# EAGLE design ESP32 (EAGLE 9.6.2)
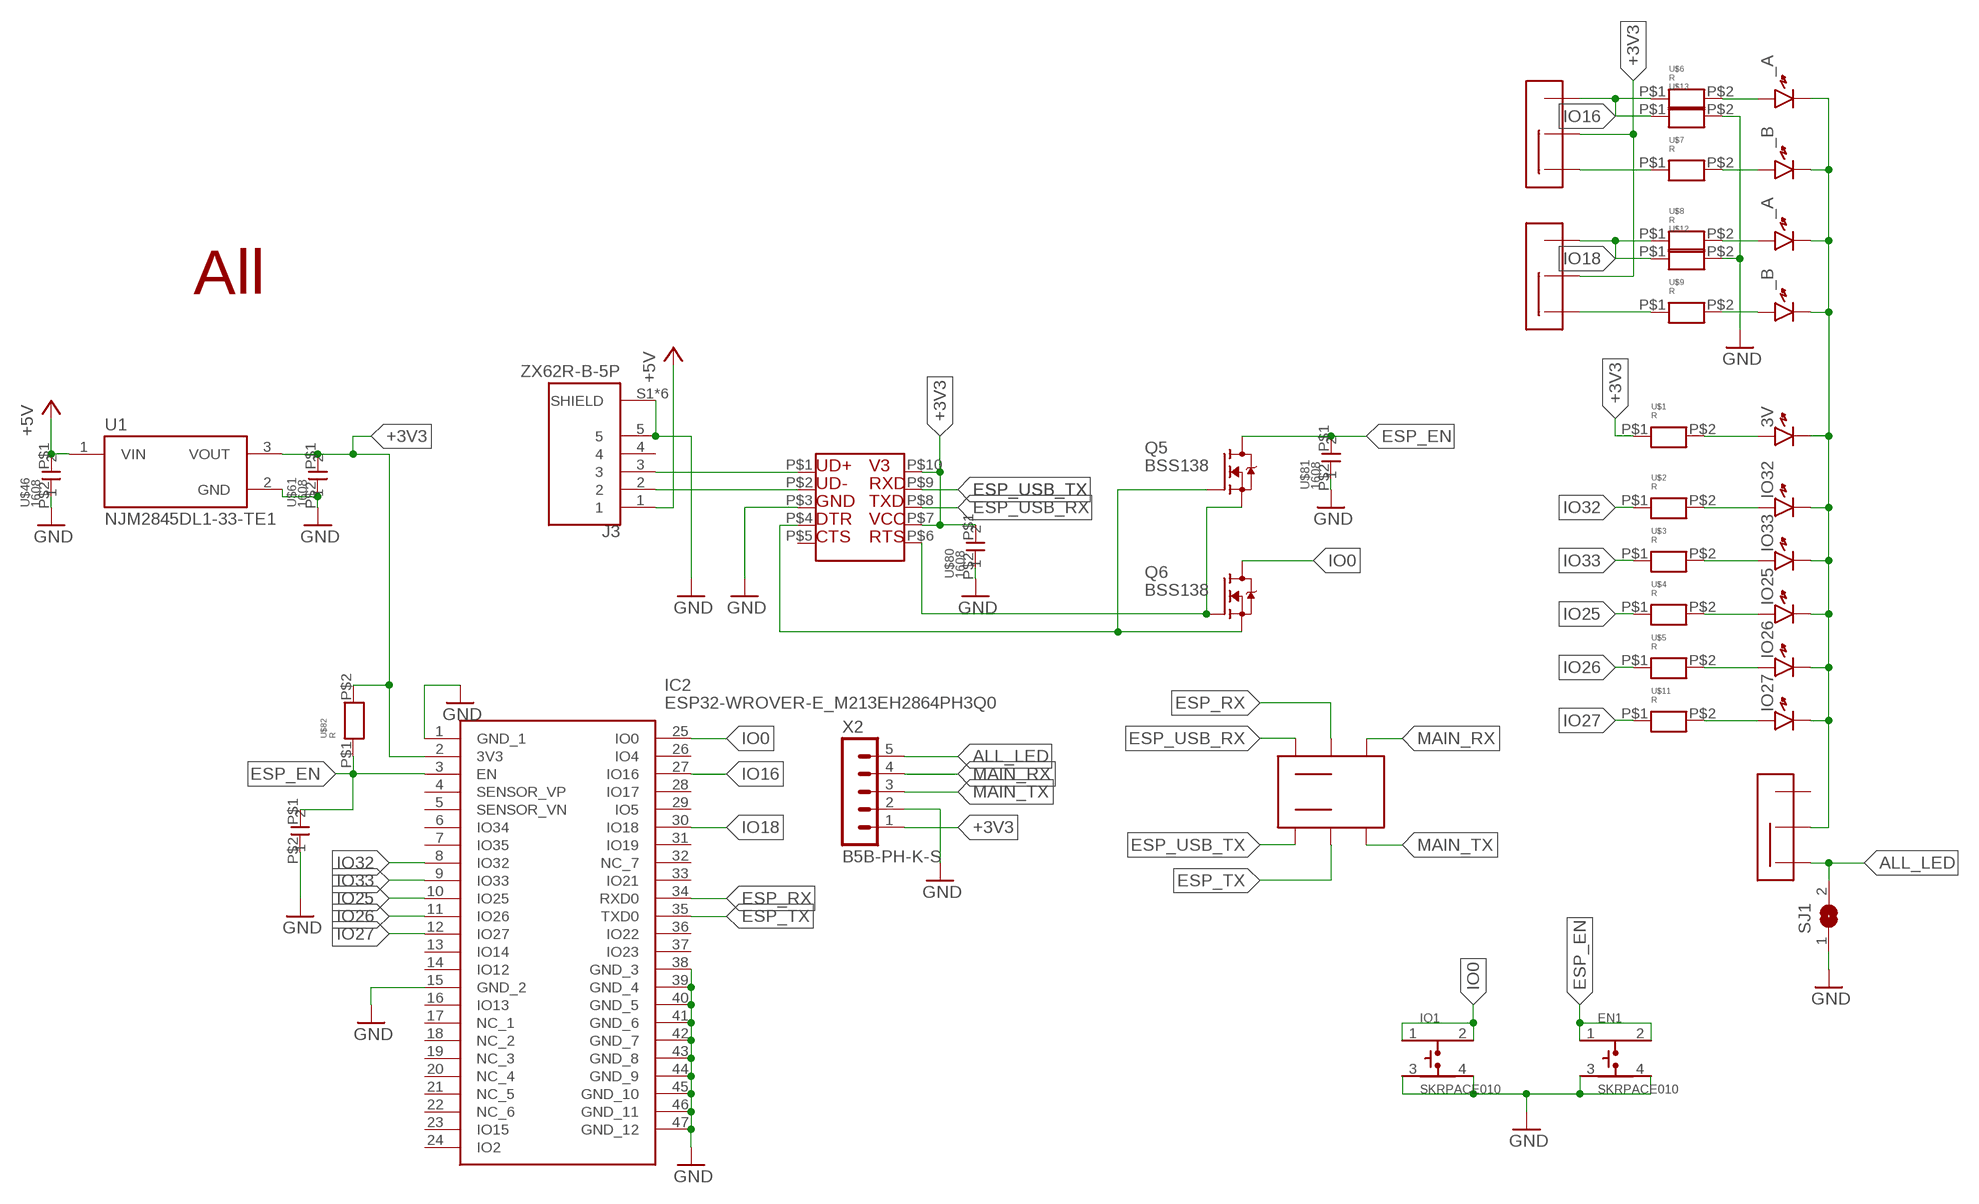
[diagram p0: schematic, sheet 1]

## Parts
3V  LED1608  [LED1608]
EN1  SKRPACE010  [SW_SKRPACE010]
IC2  ESP32-WROVER-E_M213EH2864PH3Q0  [ESP32WROVEREM213EH2864PH3Q0]
IO1  SKRPACE010  [SW_SKRPACE010]
IO25  LED1608  [LED1608]
IO26  LED1608  [LED1608]
IO27  LED1608  [LED1608]
IO32  LED1608  [LED1608]
IO33  LED1608  [LED1608]
J3  ZX62R-B-5P  [HRS_ZX62R-B-5P]
Q5  BSS138  [SOT23]
Q6  BSS138  [SOT23]
SJ1  SJ  [SJ]
U1  NJM2845DL1-33-TE1  [DPAK228P968X238-4N]
U$1  R  [1608]
U$2  R  [1608]
U$3  R  [1608]
U$4  R  [1608]
U$5  R  [1608]
U$6  R  [1608]
U$7  R  [1608]
U$8  R  [1608]
U$9  R  [1608]
U$10  SSW  [SSW]
U$11  R  [1608]
U$12  R  [1608]
U$13  R  [1608]
U$14  ALL  [ALL]
U$46  1608  [CON]
U$61  1608  [CON]
U$79  CH340K  [CH340K]
U$80  1608  [CON]
U$81  1608  [CON]
U$82  R  [1608]
U$83  1608  [CON]
U$84  2SW  [2SW]
U$89  SSW  [SSW]
U$90  SSW  [SSW]
X2  B5B-PH-K-S  [B5B-PH-K-S]
Ⅰ_A  LED1608  [LED1608]
Ⅰ_B  LED1608  [LED1608]
Ⅱ_A  LED1608  [LED1608]
Ⅱ_B  LED1608  [LED1608]

## Nets
+3V3 [New Class]: IC2.2(3V3) U1.3(VOUT) U$1.P$1 U$61.P$1 U$79.P$7 U$79.P$10 U$80.P$1 U$82.P$2 U$89.P$3 U$90.P$3 X2.1
+5V [New Class]: J3.1 U1.1(VIN) U$46.P$1
ALL_LED [New Class]: SJ1.2 U$10.P$1 X2.5
ESP_EN: EN1.1 EN1.2 IC2.3(EN) Q5.3(D) U$81.P$1 U$82.P$1 U$83.P$1
ESP_RX: IC2.34(RXD0) U$84.P$2
ESP_TX: IC2.35(TXD0) U$84.P$5
ESP_USB_RX: U$79.P$8 U$84.P$1
ESP_USB_TX: U$79.P$9 U$84.P$6
GND [New Class]: EN1.3 EN1.4 IC2.1(GND_1) IC2.15(GND_2) IC2.38(GND_3) IC2.39(GND_4) IC2.40(GND_5) IC2.41(GND_6) IC2.42(GND_7) IC2.43(GND_8) IC2.44(GND_9) IC2.45(GND_10) IC2.46(GND_11) IC2.47(GND_12) IO1.3 IO1.4 J3.5 J3.S1(SHIELD) J3.S2(SHIELD) J3.S3(SHIELD) J3.S4(SHIELD) J3.S5(SHIELD) J3.S6(SHIELD) SJ1.1 U1.2(GND) U$12.P$2 U$13.P$2 U$46.P$2 U$61.P$2 U$79.P$3 U$80.P$2 U$81.P$2 U$83.P$2 X2.2
IO0: IC2.25(IO0) IO1.1 IO1.2 Q6.3(D)
IO16: IC2.27(IO16) U$6.P$1 U$13.P$1 U$89.P$2
IO18: IC2.30(IO18) U$8.P$1 U$12.P$1 U$90.P$2
IO25: IC2.10(IO25) U$4.P$1
IO26: IC2.11(IO26) U$5.P$1
IO27: IC2.12(IO27) U$11.P$1
IO32: IC2.8(IO32) U$2.P$1
IO33: IC2.9(IO33) U$3.P$1
MAIN_RX: U$84.P$3 X2.4
MAIN_TX: U$84.P$4 X2.3
N$1: 3V.A U$1.P$2
N$2: Q5.1(G) Q6.2(S) U$79.P$4
N$3: Q5.2(S) Q6.1(G) U$79.P$6
N$4: J3.2 U$79.P$2
N$5: IO32.A U$2.P$2
N$6: J3.3 U$79.P$1
N$7: IO33.A U$3.P$2
N$8: IO25.A U$4.P$2
N$9: IO26.A U$5.P$2
N$10 [New Class]: 3V.K IO25.K IO26.K IO27.K IO32.K IO33.K U$10.P$3 Ⅰ_A.K Ⅰ_B.K Ⅱ_A.K Ⅱ_B.K
N$11: U$8.P$2 Ⅱ_A.A
N$12: IO27.A U$11.P$2
N$13: U$9.P$2 Ⅱ_B.A
N$14: U$9.P$1 U$90.P$1
N$16: U$7.P$1 U$89.P$1
N$17: U$7.P$2 Ⅰ_B.A
N$18: U$6.P$2 Ⅰ_A.A
Unconnected: IC2.4(SENSOR_VP) IC2.5(SENSOR_VN) IC2.6(IO34) IC2.7(IO35) IC2.13(IO14) IC2.14(IO12) IC2.16(IO13) IC2.17(NC_1) IC2.18(NC_2) IC2.19(NC_3) IC2.20(NC_4) IC2.21(NC_5) IC2.22(NC_6) IC2.23(IO15) IC2.24(IO2) IC2.26(IO4) IC2.28(IO17) IC2.29(IO5) IC2.31(IO19) IC2.32(NC_7) IC2.33(IO21) IC2.36(IO22) IC2.37(IO23) J3.4 U$10.P$2 U$79.P$5

## Library data of the parts
3V IO25-IO27 IO32 IO33 Ⅰ_A Ⅰ_B Ⅱ_A Ⅱ_B = generic:LED: Generic LEDs
EN1 IO1 = SKRPACE010:SKRPACE010: Switch Tactile N.O. SPST Button J-Bend 0.05A 16VDC 2.55N SMD Automotive T/R Check prices <https://pricing.snapeda.com/parts/SKRPACE010/ALPS/view-part?ref=eda>; AVAILABILITY: In Stock; DESCRIPTION: Switch Tactile N.O. SPST Button J-Bend 0.05A 16VDC 2.55N SMD Automotive T/R; MF: ALPS; MP: SKRPACE010; PACKAGE: None; PRICE: None
IC2 = ESP32:ESP32-WROVER-E_M213EH2864PH3Q0: WiFi Modules (802.11) SMD Module ESP32-D0WD-V3, 3.3V 64Mbit PSRAM, 16 MB SPI flash, PCB Antenna Source: Datasheet <https://www.mouser.in/datasheet/2/891/esp32-wrover-e_esp32-wrover-ie_datasheet_en-1855913.pdf>; DESCRIPTION: WiFi Modules (802.11) SMD Module ESP32-D0WD-V3, 3.3V 64Mbit PSRAM, 16 MB SPI flash, PCB Antenna; HEIGHT: 3.45mm; MANUFACTURER_NAME: Espressif Systems; MANUFACTURER_PART_NUMBER: ESP32-WROVER-E(M213EH2864PH3Q0); MOUSER_PART_NUMBER: 356-ESP32WRVE22864PC; MOUSER_PRICE-STOCK: https://www.mouser.co.uk/ProductDetail/Espressif-Systems/ESP32-WROVER-EM213EH2864PH3Q0?qs=vmHwEFxEFR8kG00CaGIvFQ%3D%3D
J3 = USBMicro:ZX62R-B-5P: Conn Micro USB 2.0 Type B RCP 5 POS 0.65mm Solder RA SMD 5 Terminal 1 Port Embossed T/R Check prices <https://pricing.snapeda.com/parts/ZX62R-B-5P/Hirose/view-part?ref=eda>; AVAILABILITY: In Stock; DESCRIPTION: USB - micro B USB 2.0 Receptacle Connector 5 Position Surface Mount, Right Angle; MF: Hirose; MP: ZX62R-B-5P; PACKAGE: None; PRICE: None
Q5 Q6 = bss138_10:BSS138: BSS138 N-Channel Logic Level Enhancement Mode Field Effect Transistor Source: http://www.fairchildsemi.com/datasheets/BS/BSS138.pdf; MF: Fairchild; MPN: BSS138; OC_FARNELL: 9845330; OC_NEWARK: 67R2009
SJ1 = jumper:SJ: SMD solder JUMPER
U1 = NJM2845DL1-33-TE1:NJM2845DL1-33-TE1: NJM2845 Series 800 mA 3.3 V Fixed Output SMT LDO Regulator - TO-252 Check prices <https://pricing.snapeda.com/parts/NJM2845DL1-33-TE1/NJR%20Corporation/NJRC/view-part?ref=eda>; AVAILABILITY: Not in stock; DESCRIPTION: Linear Voltage Regulator IC Positive Fixed 1 Output 800mA TO-252-3; MF: NJR Corporation/NJRC; MP: NJM2845DL1-33-TE1; PACKAGE: TO-252-3 New Japan Radio; PRICE: None
U$1-U$9 U$11-U$13 U$82 = R 1608:R
U$10 U$89 U$90 = SSW:SSW
U$14 = All_outlook:ALL
U$46 U$61 U$80 U$81 U$83 = con1608:1608
U$79 = CH340K:CH340K
U$84 = 2SW:2SW
X2 = con-JST PH:B5B-PH: JST PH series header 2.00mm pitch disconnectable crimp style connectors, vertical (side entry type), 5 pins

## Net classes
2 New Class: width 0.254 mm

## Board
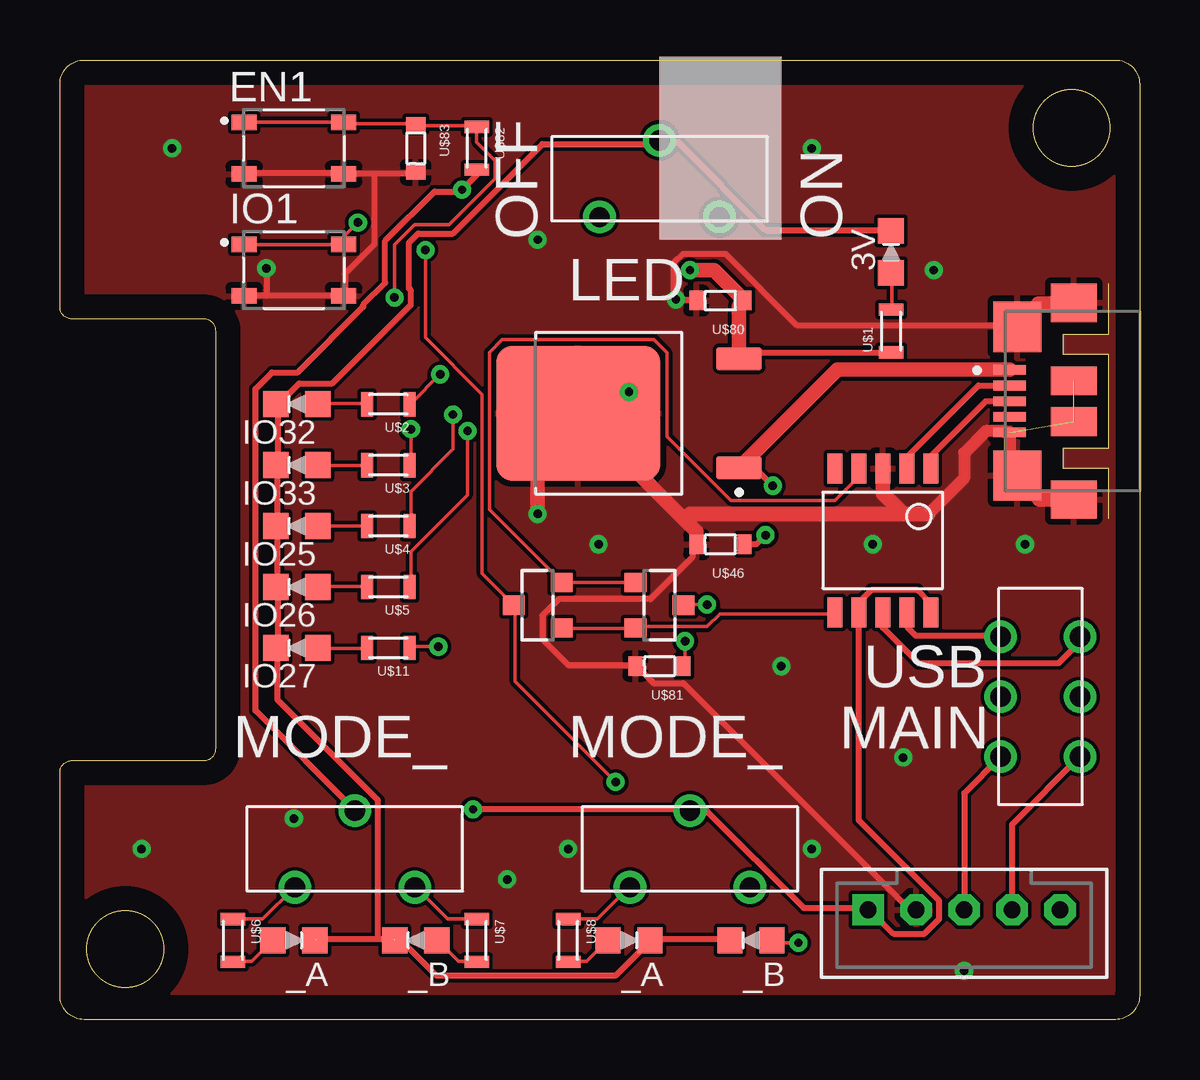
[diagram p1: board, top side]
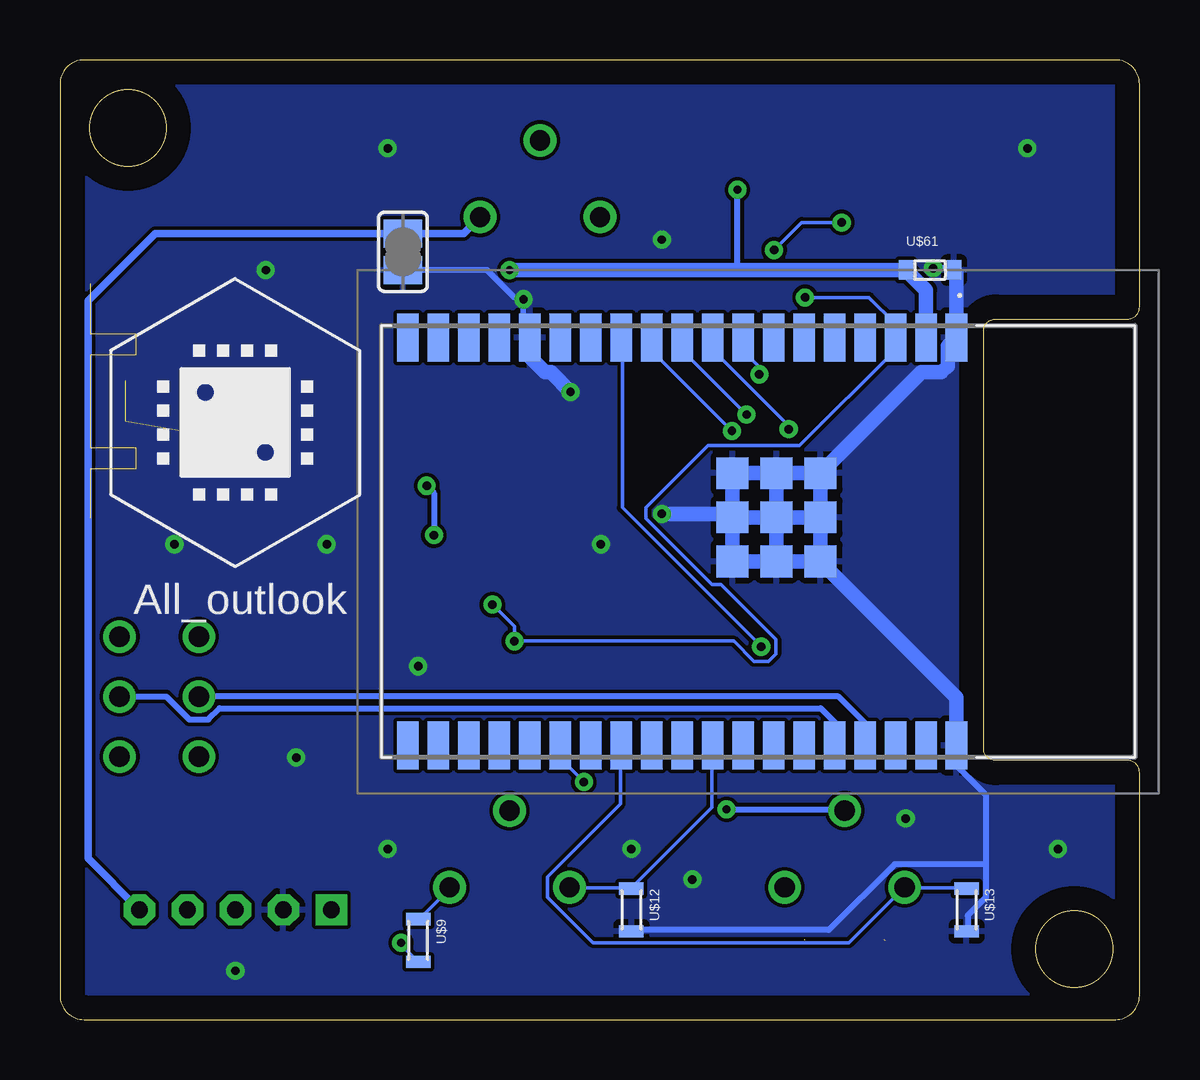
[diagram p2: board, bottom side, seen from below]

Size 45 x 40 mm. Coordinates in mm from the lower left corner, seen from the top.
Outline: 6,29.2 0.5,29.2 arc-90 0,29.7 0,39 arc-90 1,40 44,40 arc-90 45,39 45,1 arc-90 44,0 1,0 arc-90 0,1 0,10.3 arc-90 0.5,10.8 6,10.8 arc90 6.5,11.3 6.5,28.7 arc90 6,29.2
Outline: circle at 2.72,2.93 radius 1.6
Outline: circle at 42.17,37.17 radius 1.6
Copper layers (1*16): Top 0.035mm / dielectric 1.5mm / Bottom 0.035mm
Design rules "default": minimum track width 6mil, minimum drill 0.35mm, track to track 6mil, track to pad 6mil, pad to pad 6mil, via to via 6mil, smd to smd 6mil, copper to edge 40mil, drill to drill 6mil, minimum pad ring 10mil, minimum via ring 8mil, stop-mask expansion 4mil, vias tented up to drill 0mil, thermal gap 10mil

### Footprints (pad centres in the part's own frame; a part is rotated, then mirrored left to right if it is on the bottom)
LED1608 = smd 1.05 x 1.08: A -0.875,0; K 0.875,0
SW_SKRPACE010 = smd 1.05 x 0.65: 1 -2.075,1.075; 2 2.075,1.075; 3 -2.075,-1.075; 4 2.075,-1.075
ESP32WROVEREM213EH2864PH3Q0 = smd 2 x 0.9: 1 -8.5,23.96; 2 -8.5,22.69; 3 -8.5,21.42; 4 -8.5,20.15; 5 -8.5,18.88; 6 -8.5,17.61; 7 -8.5,16.34; 8 -8.5,15.07; 9 -8.5,13.8; 10 -8.5,12.53; 11 -8.5,11.26; 12 -8.5,9.99; 13 -8.5,8.72; 14 -8.5,7.45; 15 -8.5,6.18; 16 -8.5,4.91; 17 -8.5,3.64; 18 -8.5,2.37; 19 -8.5,1.1; 20 8.5,1.1; 21 8.5,2.37; 22 8.5,3.64; 23 8.5,4.91; 24 8.5,6.18; 25 8.5,7.45; 26 8.5,8.72; 27 8.5,9.99; 28 8.5,11.26; 29 8.5,12.53; 30 8.5,13.8; 31 8.5,15.07; 32 8.5,16.34; 33 8.5,17.61; 34 8.5,18.88; 35 8.5,20.15; 36 8.5,21.42; 37 8.5,22.69; 38 8.5,23.96 | smd 1.33 x 1.33: 39 -1,16.46; 40 0.835,16.46; 41 0.835,14.625; 42 -1,14.625; 43 -2.835,14.625; 44 -2.835,16.46; 45 -2.835,18.295; 46 -1,18.295; 47 0.835,18.295
HRS_ZX62R-B-5P = smd 0.4 x 1.35: 1 1.3,2.675; 2 0.65,2.675; 3 0,2.675; 4 -0.65,2.675; 5 -1.3,2.675 | smd 2.1 x 2: S1 -3.1,2.35; S2 3.1,2.35 | smd 1.6 x 1.9: S3 -4.1,0; S4 4.1,0 | smd 1.2 x 1.9: S5 -0.85,0; S6 0.85,0
SOT23 = smd 0.8 x 0.9: 1 -0.95,-1; 2 0.95,-1; 3 0,1
SJ = smd 1.168 x 1.6: 1 -0.762,0; 2 0.762,0
DPAK228P968X238-4N = smd 0.96 x 1.9: 1 -2.28,-4.59; 3 2.28,-4.59 | smd 5.63 x 6.84: 2 0,2.12
1608 = smd 0.508 x 1.016: P$1 -0.889,0; P$2 0.889,0
SSW = drill 0.85: P$1 -2.5,1.6; P$2 2.5,1.6; P$3 0,-1.6
CON = smd 0.6 x 0.813: P$1 -1,0; P$2 1,0
CH340K = smd 0.635 x 1.27: P$1 0.5,-1; P$2 1.5,-1; P$3 2.5,-1; P$4 3.5,-1; P$5 4.5,-1; P$6 4.5,5; P$7 3.5,5; P$8 2.5,5; P$9 1.5,5; P$10 0.5,5
2SW = drill 0.85: P$1 -2.5,1.65; P$2 0,1.65; P$3 2.5,1.65; P$4 2.5,-1.65; P$5 0,-1.65; P$6 -2.5,-1.65
B5B-PH-K-S = drill 0.7 pad 1.3 square: 1 4,0 | drill 0.7 pad 1.3 octagon: 2 2,0; 3 0,0; 4 -2,0; 5 -4,0

### Placement (x,y rotation side)
3V  34.64,32 90 top
EN1  9.75,36.32 0 top
IC2  31.59,19.94 270 bottom
IO1  9.75,31.24 0 top
IO25  9.88,20.57 180 top
IO26  9.88,18.03 180 top
IO27  9.88,15.49 180 top
IO32  9.88,25.65 180 top
IO33  9.88,23.11 180 top
J3  42.26,25.78 90 top
Q5  24.99,17.27 270 top
Q6  19.91,17.27 90 top
SJ1  30.71,32 90 bottom
U1  23.72,25.27 90 top
U$1  34.64,28.7 90 top
U$2  13.69,25.65 180 top
U$3  13.69,23.11 180 top
U$4  13.69,20.57 180 top
U$5  13.69,18.03 180 top
U$6  7.21,3.3 270 top
U$7  17.37,3.3 270 top
U$8  21.18,3.3 270 top
U$9  30.07,3.3 270 bottom
U$10  24.99,35.05 180 top
U$11  13.69,15.49 180 top
U$12  21.18,4.57 270 bottom
U$13  7.21,4.57 270 bottom
U$14  37.69,24.89 0 bottom
U$46  27.53,19.81 180 top
U$61  8.73,31.24 0 bottom
U$79  36.8,21.97 180 top
U$80  27.53,29.97 180 top
U$81  24.99,14.73 180 top
U$82  17.37,36.32 270 top
U$83  14.83,36.32 270 top
U$84  40.87,13.46 270 top
U$89  12.29,7.11 180 top
U$90  26.26,7.11 180 top
X2  37.69,4.57 180 top
Ⅰ_A  9.75,3.3 0 top
Ⅰ_B  14.83,3.3 180 top
Ⅱ_A  23.72,3.3 0 top
Ⅱ_B  28.8,3.3 180 top

### Tracks (layer width: path | path; a pad name or v marks a point on that pad's centre or on a via)
+3V3  (via drill 0.35)
  Top 0.254: U$82.P$2 17.37,35.2 v16.76,34.59 16.68,34.52 15.62,34.52 13.56,32.46 13.56,30.71 12.65,29.79 12.65,29.72 9.9,26.97 8.84,26.97 8.15,26.29 8.15,12.88 12.27,8.76 U$89.P$3 | U$1.P$1 28.57,27.81 U1.3 | U$79.P$10 36.27,16.99 36.27,17.37 35.73,17.91 33.83,17.91 33.37,17.45 33.37,16.99 U$79.P$7 33.3,16.84 33.3,8.3 36.65,4.95 36.65,4.19 36.04,3.58 34.74,3.58 33.75,4.57 X2.1 33.6,4.65 31.01,4.65 26.97,8.68 26.36,8.68 U$90.P$3 26.21,8.76 v17.22,8.76
  Top 0.61: U1.3 28.31,29.75 U$80.P$1 27.26,31.24 v26.26,31.24
  Bottom 0.254: 16.76,31.24 v16.76,34.59 | v17.22,8.76 12.34,8.76 U$89.P$3
  Bottom 0.61: IC2.2 8.9,30.41 U$61.P$1 16.76,31.24 v26.26,31.24
+5V  (via drill 0.35)
  Top 0.254: U$46.P$1 29.03,19.81 v29.41,20.19 | v29.71,22.25 28.8,23.16 U1.1 | J3.1 39.62,27.05 J3.1
  Top 0.61: U1.1 32.41,27.09 J3.1
  Bottom 0.254: v29.41,20.19 29.41,21.94 v29.71,22.25
ALL_LED
  Bottom 0.305: X2.5 43.83,6.71 43.83,29.97 41.04,32.76 SJ1.2 28.18,32.76 U$10.P$1
ESP_EN  (via drill 0.35)
  Top 0.152: EN1.1 7.69,37.41 11.81,37.41 EN1.2 11.88,37.34 14.78,37.34 U$83.P$1 14.86,37.26 17.37,37.26 U$82.P$1 17.37,36.57 18.13,35.81 18.13,35.05 16.23,33.14 14.78,33.14 13.94,32.31 v13.94,30.1 | v26.06,15.77 26.06,14.78 U$81.P$1 | v26.97,17.3 26.06,17.3 Q5.3
  Bottom 0.152: v26.97,17.3 26.06,16.38 v26.06,15.77 16.91,15.77 16.08,14.93 15.46,14.93 15.16,15.24 15.16,15.85 17.45,18.13 17.83,18.13 20.57,20.88 20.57,21.33 17.98,23.93 14.17,23.93 10.21,27.89 10.21,28.42 IC2.3 10.21,28.5 10.21,29.03 11.27,30.1 v13.94,30.1
ESP_RX
  Bottom 0.254: IC2.34 12.62,11.53 12.62,12.3 13.29,12.97 38.35,12.97 38.82,12.5 39.61,12.5 40.57,13.46 U$84.P$2
ESP_TX
  Bottom 0.254: IC2.35 11.44,12.36 12.54,13.46 U$84.P$5
ESP_USB_RX
  Top 0.254: U$79.P$8 34.3,16.34 35.79,14.86 41.63,14.86 42.52,15.74 U$84.P$1
ESP_USB_TX
  Top 0.254: U$84.P$6 39.17,16 35.67,16 35.32,16.34 35.32,16.95 U$79.P$9
GND  (via drill 0.35)  (2 unrouted)
  Top 0.254: 8.61,30.17 11.81,30.17 IO1.4 11.88,30.25 11.88,31.09 13.1,32.31 13.1,35.28 | 8.61,30.17 7.69,30.17 IO1.3 | 13.1,35.28 11.88,35.28 EN1.4 11.73,35.28 7.69,35.28 EN1.3 | 13.1,35.28 14.78,35.28 | U$46.P$2 26.36,19.58 26.36,19.28 24.61,17.52 20.8,17.52 20.11,16.84 20.11,15.85 21.18,14.78 23.92,14.78 U$81.P$2 24.08,14.71 24.76,14.02 25.98,14.02 35.43,4.57 X2.2 | U$80.P$2 26.51,30.02 v25.68,30.02 25.6,30.1 25.6,31.55 25.98,31.93 27.73,31.93 30.71,28.95 39.62,28.95 J3.S2 | v8.61,31.32 8.61,30.17
  Top 0.508: J3.S1 39.59,23 J3.5 39.37,24.48 39.33,24.52 38.59,24.52 37.69,23.62 37.69,22.58 36.19,21.08
  Top 0.61: 42.77,22.17 42.76,22.17 J3.S3 40.83,21.68 40.61,21.9 40.61,21.98 J3.S1 | J3.S2 40.61,29.57 40.61,29.66 40.79,29.83 42.22,29.83 J3.S4 42.26,29.38 | 36.19,21.08 35.15,21.08 | 35.15,21.08 34.3,21.93 U$79.P$3 | 26.03,20.85 U1.2 21.2,24.87 | 26.03,20.85 26.53,20.34 U$46.P$2 | 26.03,20.85 26.26,21.08 35.15,21.08 | v19.91,21.08 19.91,23.58 21.2,24.87 | v23.72,26.16 22.43,24.87 21.2,24.87
  Bottom 0.254: 25.52,28.73 25.68,28.88 v25.68,30.02 25.75,30.1 26.06,30.1 27.2,31.24 SJ1.1 | 6.4,6.47 6.4,9.37 7.69,10.67 7.69,11.2 IC2.38 | 6.4,6.47 6.4,5.1 7.16,4.34 7.16,3.73 U$13.P$2 | 6.4,6.47 10.21,6.47 12.95,3.73 21.18,3.73 U$12.P$2 | IC2.1 7.69,28.5 7.82,28.25 | v8.61,31.32 8,31.32 U$61.P$2
  Bottom 0.61: IC2.1 7.63,31.14 U$61.P$2 | IC2.44 IC2.43 IC2.42 | IC2.42 IC2.39 | IC2.39 IC2.46 | IC2.46 IC2.45 | IC2.44 IC2.39 | IC2.39 IC2.40 | IC2.40 IC2.47 | IC2.47 IC2.46 | IC2.42 IC2.41 IC2.40 | IC2.42 17.11,21.08 v19.91,21.08 | IC2.44 IC2.45 | IC2.45 9.09,26.98 8.27,26.98 8,27.25 8,28.07 7.82,28.25 | IC2.38 7.63,13.44 IC2.47 | v23.72,26.16 24.54,26.98 24.78,26.98 25.41,27.61
  other vias: 4.67,36.32 19.91,32.51 31.34,36.32 36.42,31.24 40.23,19.81 33.88,19.81 30.07,14.73 35.15,10.92 31.34,7.11 37.69,2.03 18.64,5.84 21.18,7.11 9.75,8.38 3.4,7.11 22.45,19.81
  pour Top: -6.76,-1.78 46.58,-1.78 46.58,41.4 -2.95,41.4 -6.76,41.4
  pour Bottom: -6.76,41.4 46.58,41.4 46.58,-1.78 -6.76,-1.78
IO0  (via drill 0.35)
  Top 0.152: IO1.1 7.69,32.31 11.81,32.31 IO1.2 11.88,32.38 11.88,32.69 v12.42,33.22 | v23.16,9.9 18.97,14.1 18.97,17.22 Q6.3 18.89,17.3 17.6,18.59 17.6,26.06 15.24,28.42 v15.24,32.08
  Bottom 0.152: v23.16,9.9 24.08,10.82 24.08,11.43 IC2.25 | v12.42,33.22 14.09,33.22 v15.24,32.08
IO16
  Top 0.152: U$6.P$1 8.46,4.19 9.75,5.48 U$89.P$2
  Bottom 0.152: U$13.P$1 7.23,5.48 9.75,5.48 U$89.P$2 9.83,5.48 12.11,3.2 22.78,3.2 24.69,5.1 24.69,5.94 21.64,8.99 21.64,11.43 IC2.27
IO18
  Top 0.152: U$8.P$1 22.4,4.19 23.7,5.48 U$90.P$2
  Bottom 0.152: 21.18,5.48 23.7,5.48 U$90.P$2 | 21.18,5.48 17.83,8.84 17.83,11.43 IC2.30 | 21.18,5.48 U$12.P$1
IO25  (via drill 0.35)
  Top 0.152: v16.38,25.22 16.38,23.77 14.63,22.02 14.63,20.57 U$4.P$1
  Bottom 0.152: v16.38,25.22 19.05,27.89 19.05,28.42 IC2.10
IO26  (via drill 0.35)
  Top 0.152: v16.99,24.53 16.99,21.87 14.63,19.5 14.63,18.06 U$5.P$1
  Bottom 0.152: v16.99,24.53 20.27,27.81 20.27,28.42 IC2.11
IO27  (via drill 0.35)
  Top 0.152: v15.77,15.54 14.63,15.54 U$11.P$1
  Bottom 0.152: v15.77,15.54 21.56,21.33 21.56,28.42 IC2.12
IO32  (via drill 0.35)
  Top 0.152: v15.85,26.9 14.63,25.68 U$2.P$1
  Bottom 0.152: v15.85,26.9 15.85,27.2 16.46,27.81 16.46,28.42 IC2.8
IO33  (via drill 0.35)
  Top 0.152: v14.63,24.61 14.63,23.16 U$3.P$1
  Bottom 0.152: v14.63,24.61 14.63,24.76 17.75,27.89 17.75,28.42 IC2.9
MAIN_RX
  Top 0.254: X2.4 39.69,8.13 U$84.P$3
MAIN_TX
  Top 0.254: U$84.P$4 37.69,9.43 X2.3
N$1
  Top 0.152: U$1.P$2 34.67,29.64 34.67,31.09 3V.A
N$2
  Top 0.152: Q5.1 23.92,18.21 20.95,18.21 Q6.2 20.88,18.29 17.9,21.26 17.9,27.81 18.44,28.34 24.76,28.34 25.3,27.81 25.3,24.31 27.96,21.64 32.3,21.64 33.3,22.63 33.3,22.93 U$79.P$4
N$3
  Top 0.152: Q6.1 20.95,16.3 23.92,16.3 Q5.2 24,16.38 26.97,16.38 27.51,16.91 32.23,16.91 U$79.P$6
N$4
  Top 0.254: U$79.P$2 35.3,23.44 38.29,26.43 J3.2
N$5
  Top 0.152: U$2.P$2 12.8,25.68 10.82,25.68 IO32.A
N$6
  Top 0.254: U$79.P$1 36.35,23.02 36.35,23.54 38.59,25.78 J3.3
N$7
  Top 0.152: U$3.P$2 12.8,23.09 10.82,23.09 IO33.A
N$8
  Top 0.152: IO25.A U$4.P$2
N$9
  Top 0.152: U$5.P$2 12.8,18.06 10.82,18.06 IO26.A
N$10  (2 unrouted)
  Top 0.254: Ⅱ_B.K 27.89,3.35 24.61,3.35 Ⅱ_A.K 24.53,3.2 23.16,1.83 15.69,1.83 14.32,3.2 14.02,3.2 Ⅰ_B.K | 3V.K 34.59,32.92 29.41,32.92 25.75,36.57 24.99,36.57 U$10.P$3 24.91,36.5 20.11,36.5 16.38,32.76 14.93,32.76 14.55,32.38 14.55,30.48 14.63,30.4 14.63,29.79 11.35,26.52 9.98,26.52 9.14,25.68 IO32.K 9.06,25.6 9.06,23.16 IO33.K 9.06,23.01 9.06,20.65 IO25.K 9.06,20.57 9.06,18.13 IO26.K 9.06,17.98 9.06,15.54 IO27.K 9.06,15.39 9.06,13.33 13.26,9.14 13.26,3.35 | 13.94,3.35 13.26,3.35 | 13.26,3.35 10.66,3.35
N$11
  Top 0.152: U$8.P$2 21.18,2.44 21.94,2.44 22.78,3.28 Ⅱ_A.A
N$12
  Top 0.152: U$11.P$2 12.8,15.47 10.82,15.47 IO27.A
N$13  (via drill 0.35)
  Top 0.152: v30.78,3.2 29.79,3.2 29.71,3.28 Ⅱ_B.A
  Bottom 0.152: U$9.P$2 30.78,3.12 v30.78,3.2
N$14
  Bottom 0.152: U$9.P$1 30.02,4.19 28.72,5.48 U$90.P$1
N$16
  Top 0.152: U$7.P$1 16.15,4.19 14.86,5.48 U$89.P$1
N$17
  Top 0.152: U$7.P$2 17.37,2.44 16.61,2.44 15.77,3.28 Ⅰ_B.A
N$18
  Top 0.152: U$6.P$2 7.23,2.44 8,2.44 8.84,3.28 Ⅰ_A.A

### Text on the board
tPlace: OFF | ON | LED | USB | MODE_Ⅰ | MODE_Ⅱ | MAIN